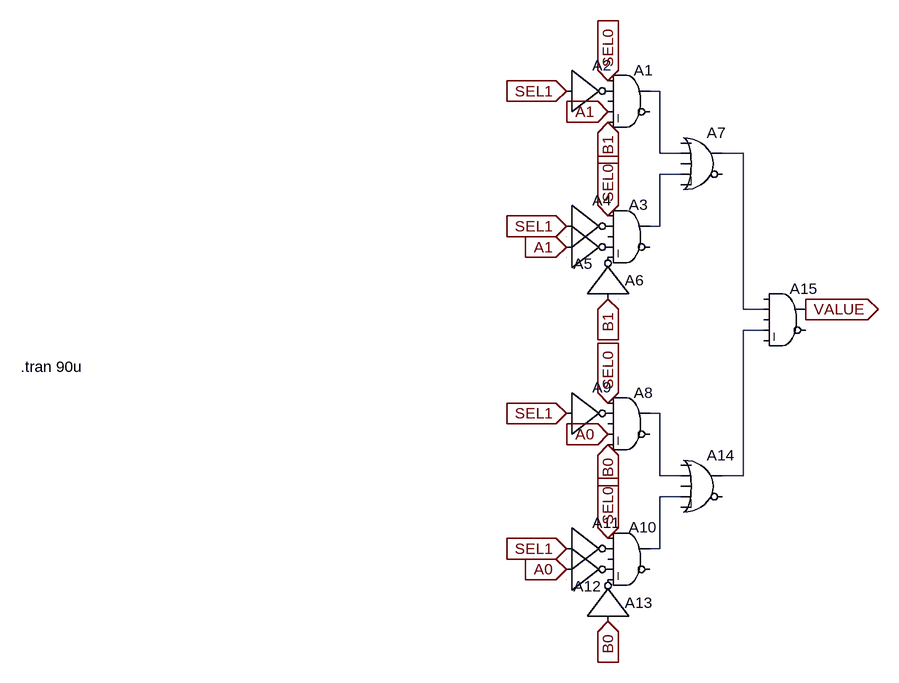
[diagram p0: schematic comparator.asc]
comparator.asc, the LTspice schematic file:
Version 4
SHEET 1 928 972
WIRE 384 64 368 64
WIRE 384 160 384 64
WIRE 416 160 384 160
WIRE 512 160 480 160
WIRE 416 192 384 192
WIRE 384 272 384 192
WIRE 384 272 368 272
WIRE 512 400 512 160
WIRE 544 400 512 400
WIRE 544 432 512 432
WIRE 384 560 368 560
WIRE 384 656 384 560
WIRE 416 656 384 656
WIRE 512 656 512 432
WIRE 512 656 480 656
WIRE 416 688 384 688
WIRE 384 768 384 688
WIRE 384 768 368 768
FLAG 304 96 A1
IOPIN 304 96 In
FLAG 304 112 B1
IOPIN 304 112 In
FLAG 240 64 SEL1
IOPIN 240 64 In
FLAG 608 400 VALUE
IOPIN 608 400 Out
FLAG 304 48 SEL0
IOPIN 304 48 In
FLAG 240 272 SEL1
IOPIN 240 272 In
FLAG 304 256 SEL0
IOPIN 304 256 In
FLAG 240 304 A1
IOPIN 240 304 In
FLAG 304 384 B1
IOPIN 304 384 In
FLAG 304 592 A0
IOPIN 304 592 In
FLAG 304 608 B0
IOPIN 304 608 In
FLAG 240 560 SEL1
IOPIN 240 560 In
FLAG 304 544 SEL0
IOPIN 304 544 In
FLAG 240 768 SEL1
IOPIN 240 768 In
FLAG 304 752 SEL0
IOPIN 304 752 In
FLAG 240 800 A0
IOPIN 240 800 In
FLAG 304 880 B0
IOPIN 304 880 In
SYMBOL Digital\\and 336 16 R0
SYMATTR InstName A1
SYMBOL Digital\\inv 240 0 R0
SYMATTR InstName A2
SYMBOL Digital\\and 336 224 R0
WINDOW 0 0 15 Left 2
SYMATTR InstName A3
SYMBOL Digital\\inv 240 208 R0
SYMATTR InstName A4
SYMBOL Digital\\inv 240 240 R0
WINDOW 0 11 90 Left 2
SYMATTR InstName A5
SYMBOL Digital\\inv 240 384 R270
WINDOW 0 29 90 VRight 2
SYMATTR InstName A6
SYMBOL Digital\\or 448 112 R0
SYMATTR InstName A7
SYMBOL Digital\\and 336 512 R0
SYMATTR InstName A8
SYMBOL Digital\\inv 240 496 R0
SYMATTR InstName A9
SYMBOL Digital\\and 336 720 R0
WINDOW 0 0 15 Left 2
SYMATTR InstName A10
SYMBOL Digital\\inv 240 704 R0
SYMATTR InstName A11
SYMBOL Digital\\inv 240 736 R0
WINDOW 0 11 90 Left 2
SYMATTR InstName A12
SYMBOL Digital\\inv 240 880 R270
WINDOW 0 29 90 VRight 2
SYMATTR InstName A13
SYMBOL Digital\\or 448 608 R0
SYMATTR InstName A14
SYMBOL Digital\\and 576 352 R0
SYMATTR InstName A15
TEXT -600 488 Left 2 !.tran 90u

The netlist it stands for:
* comparator.asc
A1 SEL0 P001 0 A1 B1 0 N001 0 AND
A2 SEL1 0 0 0 0 P001 0 0 BUF
A3 SEL0 P002 0 P003 P004 0 N003 0 AND
A4 SEL1 0 0 0 0 P002 0 0 BUF
A5 A1 0 0 0 0 P003 0 0 BUF
A6 B1 0 0 0 0 P004 0 0 BUF
A7 0 N001 0 N003 0 0 N002 0 OR
A8 SEL0 P005 0 A0 B0 0 N005 0 AND
A9 SEL1 0 0 0 0 P005 0 0 BUF
A10 SEL0 P006 0 P007 P008 0 N006 0 AND
A11 SEL1 0 0 0 0 P006 0 0 BUF
A12 A0 0 0 0 0 P007 0 0 BUF
A13 B0 0 0 0 0 P008 0 0 BUF
A14 0 N005 0 N006 0 0 N004 0 OR
A15 0 N002 0 N004 0 0 VALUE 0 AND
.tran 90u
.backanno
.end